# Altium schematic sheet 03_Power.SchDoc
size A4
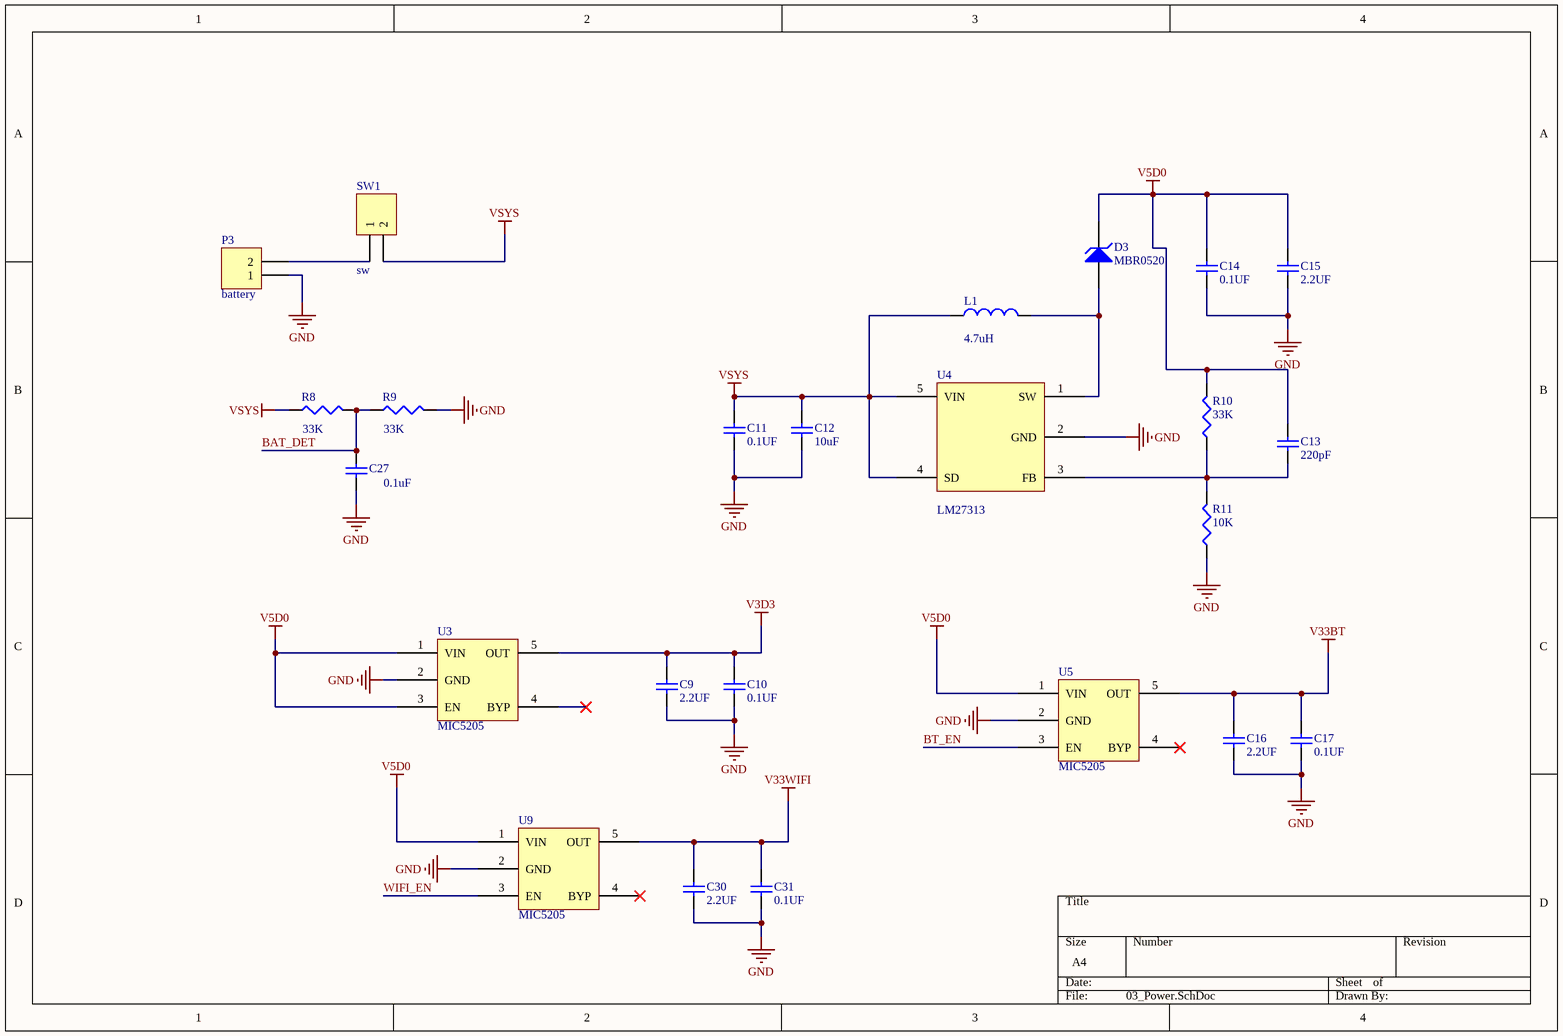
[diagram p0: 03_Power.SchDoc]

## Parts
C9  value 2.2UF  [0402]  (hidden comment: Cap)
C10  value 0.1UF  [0402]  (hidden comment: Cap)
C11  value 0.1UF  [0402]  (hidden comment: Cap)
C12  value 10uF  [0402]  (hidden comment: Cap)
C13  value 220pF  [0402]  (hidden comment: Cap)
C14  value 0.1UF  [0402]  (hidden comment: Cap)
C15  value 2.2UF  [0402]  (hidden comment: Cap)
C16  value 2.2UF  [0402]  (hidden comment: Cap)
C17  value 0.1UF  [0402]  (hidden comment: Cap)
C27  value 0.1uF  [0402]  (hidden comment: Cap)
C30  value 2.2UF  [0402]  (hidden comment: Cap)
C31  value 0.1UF  [0402]  (hidden comment: Cap)
D3  MBR0520  [6-0805_N]
L1  value 4.7uH  [0402-A]  (hidden comment: Inductor)
P3  battery  [HDR1X2]
R8  value 33K  [0402]  (hidden comment: Res3)
R9  value 33K  [0402]  (hidden comment: Res3)
R10  value 33K  [0402]  (hidden comment: Res3)
R11  value 10K  [0402]  (hidden comment: Res3)
SW1  sw  [HDR1X2]
U3  MIC5205  [SOT25-5]
U4  LM27313  [SOT25-5]
U5  MIC5205  [SOT25-5]
U9  MIC5205  [SOT25-5]

## Nets
GND: C9.2 C10.2 C11.2 C12.2 C14.2 C15.2 C16.2 C17.2 C27.1 C30.2 C31.2 P3.1 R9.2 R11.1 U3.2(GND) U4.2(GND) U5.2(GND) U9.2(GND)
V3D3: C9.1 C10.1 U3.5(OUT)
V5D0: C13.1 C14.1 C15.1 D3.2(K) R10.2 U3.1(VIN) U3.3(EN) U5.1(VIN) U9.1(VIN)
V33BT: C16.1 C17.1 U5.5(OUT)
V33WIFI: C30.1 C31.1 U9.5(OUT)
VSYS: C11.1 C12.1 L1.1 R8.1 SW1.2 U4.4(SD) U4.5(VIN)
BAT_DET: C27.2 R8.2 R9.1
BT_EN: U5.3(EN)
WIFI_EN: U9.3(EN)
NetC13_2: C13.2 R10.1 R11.2 U4.3(FB)
NetD3_1: D3.1(A) L1.2 U4.1(SW)
NetP3_2: P3.2 SW1.1

Not connected (* = marked no-connect by the designer): U3 4(BYP)*; U5 4(BYP)*; U9 4(BYP)*

## Library data of the parts
C9-C17 C27 C30 C31 = Cap: Capacitor; Published: 8-Jun-2000; LatestRevisionDate: 17-Jul-2002; LatestRevisionNote: Re-released for DXP Platform.; PackageReference: RAD-0.3; Publisher: Altium Limited; PackageDescription: Radial Cap, Thru-Hole; 2 Leads; 0.3 in Pin Spacing
D3 = D Zener: Zener Diode; Published: 8-Jun-2000; LatestRevisionDate: 17-Jul-2002; LatestRevisionNote: Re-released for DXP Platform.; PackageReference: DIODE-0.7; Publisher: Altium Limited; PackageDescription: Diode, Thru-Hole; 2 Leads; 0.7 in Pin Spacing
L1 = Inductor: Code_IEC: 1005; Published: 8-Jun-2000; LatestRevisionDate: 29-May-2009; LatestRevisionNote: IPC-7351 Footprint Added.; PackageReference: 0402-A; Publisher: Altium Limited; PackageDescription: Chip Inductor; Code_JEITA: 0402
P3 SW1 = Header 2: Header, 2-Pin; LatestRevisionDate: 17-Jul-2002; LatestRevisionNote: Re-released for DXP Platform.; Publisher: Altium Limited
R8-R11 = Res3: Resistor; Published: 8-Jun-2000; LatestRevisionDate: 29-May-2009; LatestRevisionNote: IPC-7351 Footprint Added.; PackageReference: J1-0603; Publisher: Altium Limited; PackageDescription: Chip Resistor